# EAGLE design Zio Qwiic RTC DS3231SN (EAGLE 9.1.1)
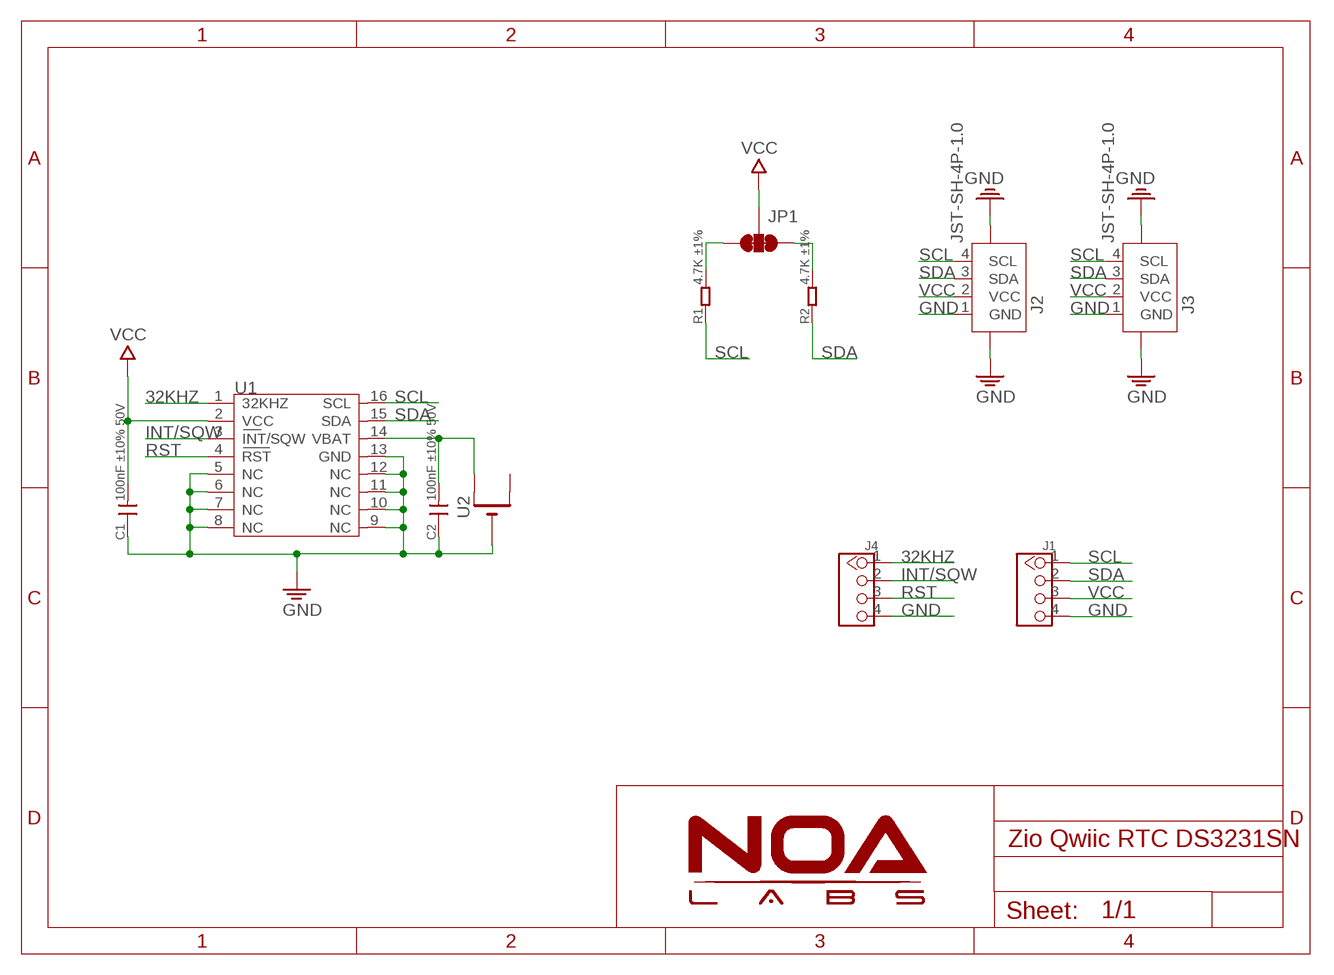
[diagram p0: schematic, sheet 1]

## Parts
C1  100nF ±10% 50V  C-0603  [C0603]
C2  100nF ±10% 50V  C-0603  [C0603]
J1  HEADER-4P-60/35MIL  [4P-65/35MIL]
J2  JST-SH-4P-1.0  [JST-SH-4P]
J3  JST-SH-4P-1.0  [JST-SH-4P]
J4  HEADER-4P-60/35MIL  [4P-65/35MIL]
JP1  SMT-JUMPER_3_2-NC_TRACE  [SMT-JUMPER_3_2-NC_TRACE]
R1  4.7K ±1%  R-0603  [R0603]
R2  4.7K ±1%  R-0603  [R0603]
U1  DS3231  [SO16-W]
U2  CR1220SMT  [CR1220-SMD]

## Nets
32KHZ: J4.1 U1.1(32KHZ)
GND: C1.1 C2.1 J1.4 J2.1(GND) J2.NC1 J2.NC2 J3.1(GND) J3.NC1 J3.NC2 J4.4 U1.5(NC) U1.6(NC) U1.7(NC) U1.8(NC) U1.9(NC) U1.10(NC) U1.11(NC) U1.12(NC) U1.13(GND) U2.-
INT/SQW: J4.2 U1.3(INT/SQW)
N$1: C2.2 U1.14(VBAT) U2.+$1(+)
N$6: JP1.3 R1.2
N$8: JP1.1 R2.2
RST: J4.3 U1.4(RST)
SCL: J1.1 J2.4(SCL) J3.4(SCL) R1.1 U1.16(SCL)
SDA: J1.2 J2.3(SDA) J3.3(SDA) R2.1 U1.15(SDA)
VCC: C1.2 J1.3 J2.2(VCC) J3.2(VCC) JP1.2 U1.2(VCC)
Unconnected: U2.+$2(+1)

## Library data of the parts
C1 C2 = RCL:C
J1 J4 = Connector:HEADER-4P
J2 J3 = Connector:JST-SH-4P
JP1 = NOA-Jumpers:SMT-JUMPER_3_2-NC_TRACE
R1 R2 = RCL:R
U1 = IC:DS3231: Extremely Accurate I2C-Integrated RTC/TCXO/Crystal http://pdfserv.maxim-ic.com/en/ds/DS3231.pdf
U2 = Shooting Star:CR1220: CR1216/CR1220/CR1225 12mm 3V lithium coin cell Great for battery packup. Both SMT and THM holders. Note the THM package has the ground pads on both sides of the PCB so that the masks are the same - this reduces the cost

## Board
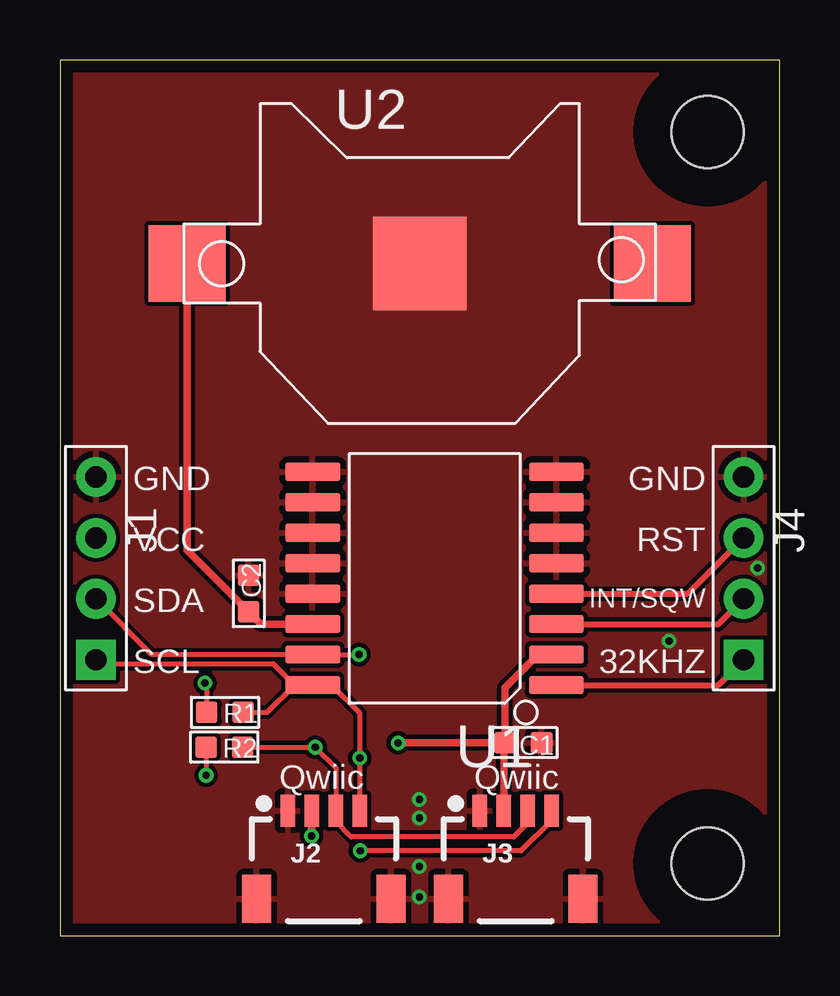
[diagram p1: board, top side]
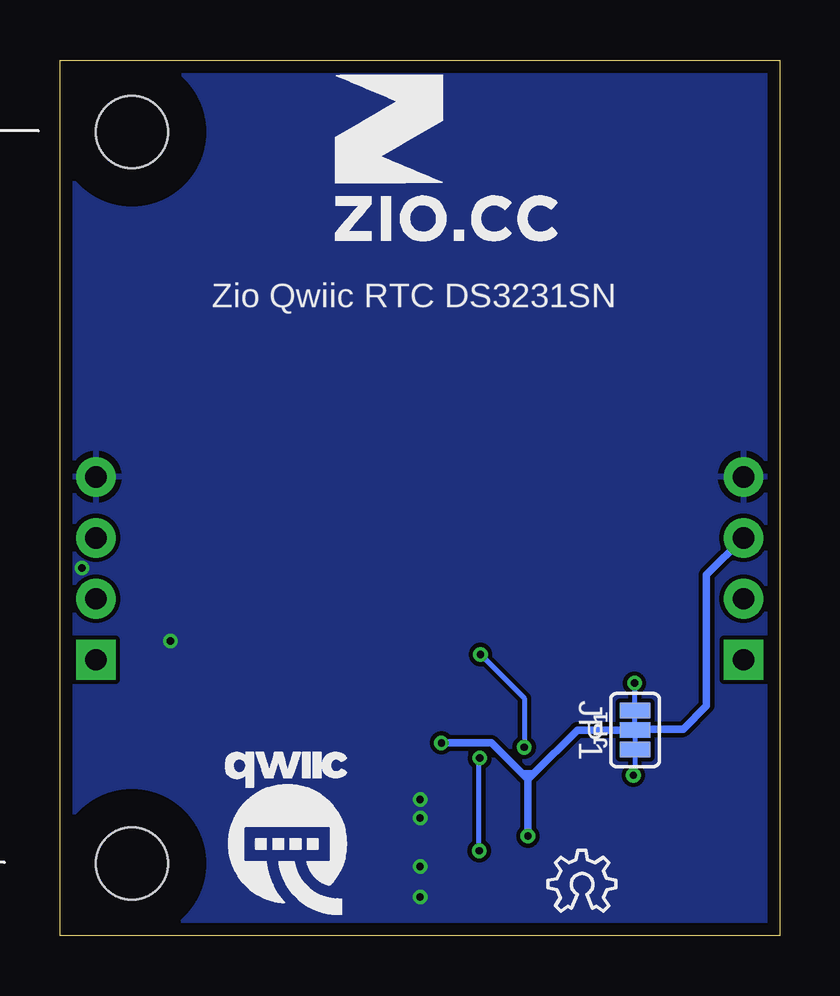
[diagram p2: board, bottom side, seen from below]

Size 30 x 36.48 mm. Coordinates in mm from the lower left corner, seen from the top.
Outline: 0,0 30,0 30,36.48 0,36.48 0,0
Copper layers (1*16): Top 0.035mm / dielectric 1.5mm / Bottom 0.035mm
Design rules "NOA Eagle Rule": minimum track width 7mil, minimum drill 12mil, track to track 7mil, track to pad 7mil, pad to pad 7mil, via to via 7mil, smd to smd 0mil, copper to edge 20mil, drill to drill 10mil, minimum pad ring 10mil, minimum via ring 6mil, stop-mask expansion 2mil, vias tented up to drill 25mil, thermal gap 10mil
Holes 3 mm at 27,33.48 27,3
tRestrict: area 24,30.5 to 30,36.5; area 24,0 to 30,6
bRestrict: area 24,30.5 to 30,36.5; area 24,0 to 30,6

### Footprints (pad centres in the part's own frame; a part is rotated, then mirrored left to right if it is on the bottom)
C0603 = smd 0.889 x 0.889: 1 -0.762,0; 2 0.762,0
4P-65/35MIL = drill 0.889 pad 1.651 square: 1 0,3.81 | drill 0.889 pad 1.651: 2 0,1.27; 3 0,-1.27; 4 0,-3.81
JST-SH-4P = smd 0.6 x 1.35: 1 1.5,0; 2 0.5,0; 3 -0.5,0; 4 -1.5,0 | smd 1.2 x 2: NC1 -2.8,3.675; NC2 2.8,3.675
SMT-JUMPER_3_2-NC_TRACE = smd 0.635 x 1.27: 1 -0.813,0; 2 0,0; 3 0.813,0
R0603 = smd 0.889 x 0.889: 1 -0.762,0; 2 0.762,0
SO16-W = smd 0.762 x 2.286: 1 -4.445,-5.08; 2 -3.175,-5.08; 3 -1.905,-5.08; 4 -0.635,-5.08; 5 0.635,-5.08; 6 1.905,-5.08; 7 3.175,-5.08; 8 4.445,-5.08; 9 4.445,5.08; 10 3.175,5.08; 11 1.905,5.08; 12 0.635,5.08; 13 -0.635,5.08; 14 -1.905,5.08; 15 -3.175,5.08; 16 -4.445,5.08
CR1220-SMD = smd 3.2 x 3.2: +$1 -9.7,0; +$2 9.7,0 | smd 3.9 x 3.9: - 0,0

### Placement (x,y rotation side)
C1  19.32,8.04 180 top
C2  7.87,14.25 270 top
J1  1.5,15.3 180 top
J2  11,5.2 180 top
J3  19,5.2 180 top
J4  28.5,15.3 180 top
JP1  6.03,8.56 90 bottom
R1  6.88,9.29 180 top
R2  6.85,7.85 180 top
U1  15.62,14.88 90 top
U2  15,28 0 top
U$1  [7MM]  18.54,28.96 0 bottom
U$4  [OSHW_6X100_NOTEXT]  9.65,1.02 0 bottom
U$6  [QWIIC-LOGO-MEDIUM]  20.57,4.32 0 bottom

### Tracks (layer width: path | path; a pad name or v marks a point on that pad's centre or on a via)
32KHZ
  Top 0.254: U1.1 27.45,10.44 J4.1
GND  (via drill 0.3)
  other vias: 25.4,12.27 29.08,15.32 14.99,4.9 14.99,5.66 14.99,2.87 14.99,1.6
  pour Top (no thermals): 8.64,28.45 8.64,30.73 12.19,34.29 17.78,34.29 21.34,30.73 21.34,25.4 17.53,21.59 12.45,21.59 8.64,25.4
  pour Top: 0,36.47 30,36.47 30,0 0,0
  pour Bottom: 0,36.47 30,36.47 30,0 0,0
INT/SQW
  Top 0.254: U1.3 27.45,12.97 J4.2
N$1
  Top 0.305: U1.14 8.39,12.97 C2.2 5.3,16.06 U2.+$1
N$6  (via drill 0.3)
  Top 0.203: v6.04,10.52 6.12,10.45 R1.2
  Bottom 0.203: JP1.3 6.03,10.49 v6.04,10.52
N$8  (via drill 0.3)
  Top 0.203: R2.2 v6.09,6.68 v6.1,6.68
  Bottom 0.203: JP1.1 6.03,6.75 v6.1,6.68
RST
  Top 0.254: U1.4 26.18,14.24 J4.3
SCL  (via drill 0.3)
  Top 0.203: 9.78,10.44 U1.16 11.33,10.44 12.5,9.27 v12.5,7.39 J2.4 | 9.78,10.44 8.89,11.32 1.67,11.32 J1.1 | R1.1 8.64,9.29 9.78,10.44 | J3.4 20.5,4.8 19.23,3.53 v12.52,3.53
  Bottom 0.203: v12.52,3.53 12.52,7.37 v12.5,7.39
SDA  (via drill 0.3)
  Top 0.203: J1.2 3.83,11.71 U1.15 v12.47,11.71 | R2.1 v10.64,7.85 11.5,6.99 J2.3 11.5,4.76 12.14,4.12 18.92,4.12 19.5,4.69 J3.3
  Bottom 0.203: v12.47,11.71 10.64,9.88 v10.64,7.85
VCC  (via drill 0.3)
  Top 0.305: J3.2 18.5,7.98 C1.2 | C1.2 18.56,10.33 19.93,11.71 U1.2 | C1.2 v14.11,8.04 v14.1,8.03 | v10.49,4.14 J2.2
  Bottom 0.305: J1.3 3.05,15.02 3.05,9.58 4.02,8.6 5.98,8.6 JP1.2 8.43,8.56 10.26,6.73 | v14.1,8.03 12.01,8.03 10.68,6.69 | 10.49,6.5 v10.49,4.14 | 10.68,6.69 10.49,6.5 | 10.26,6.73 10.49,6.5 | 10.26,6.73 10.64,6.73 10.68,6.69

### Text on the board
tPlace: GND | GND | RST | VCC | INT/SQW | SDA | 32KHZ | SCL | Qwiic | Qwiic
bPlace: Zio Qwiic RTC DS3231SN | JP1